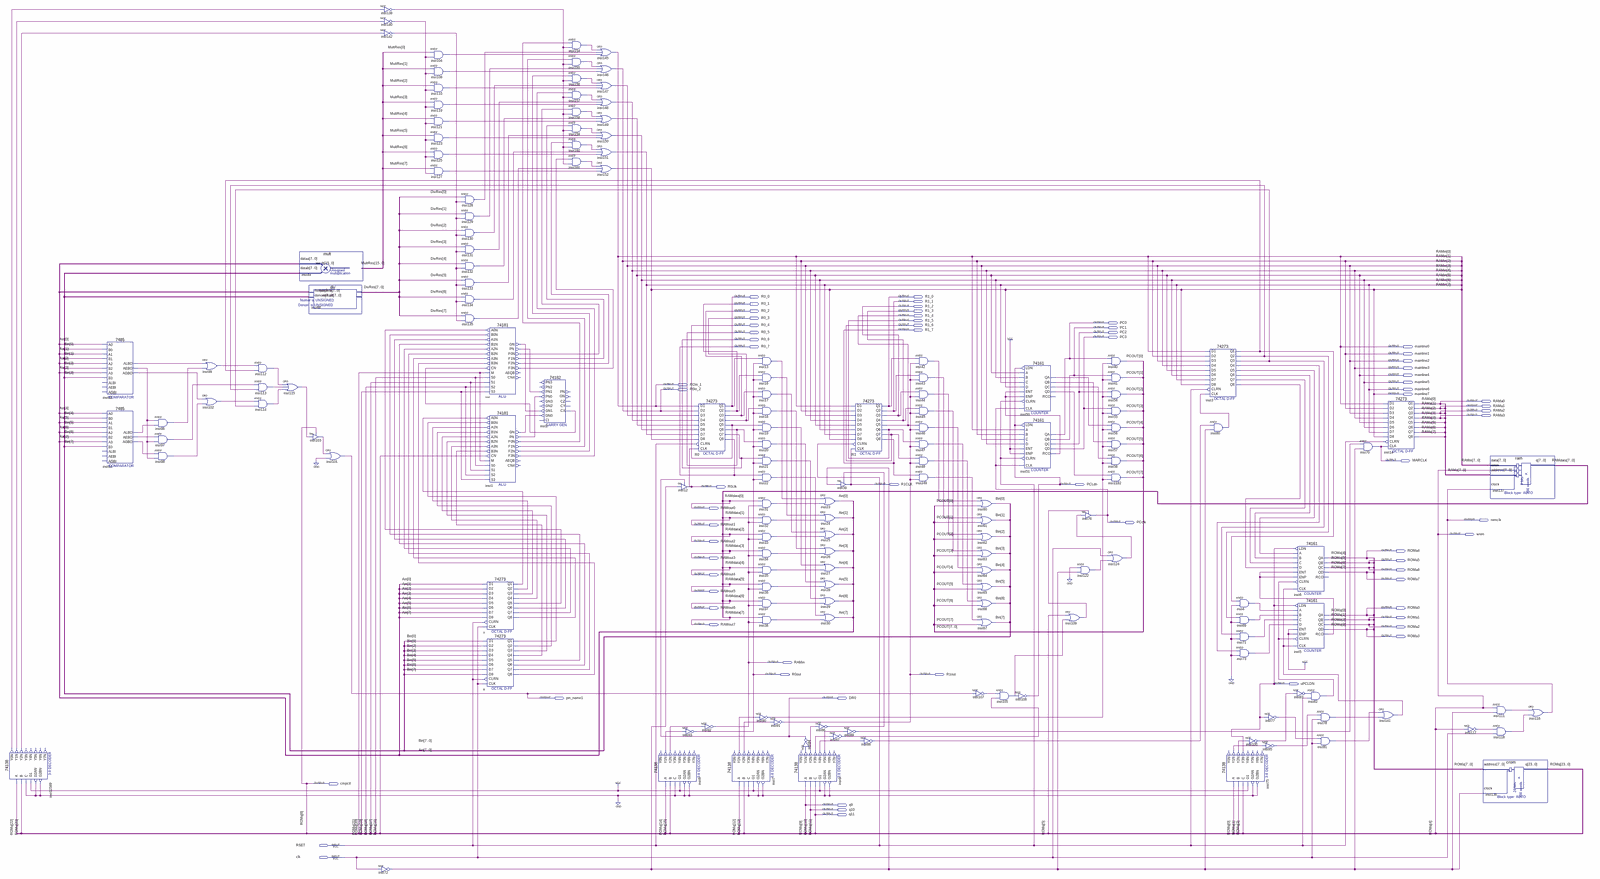
[diagram p0: schematic sheet, whole]
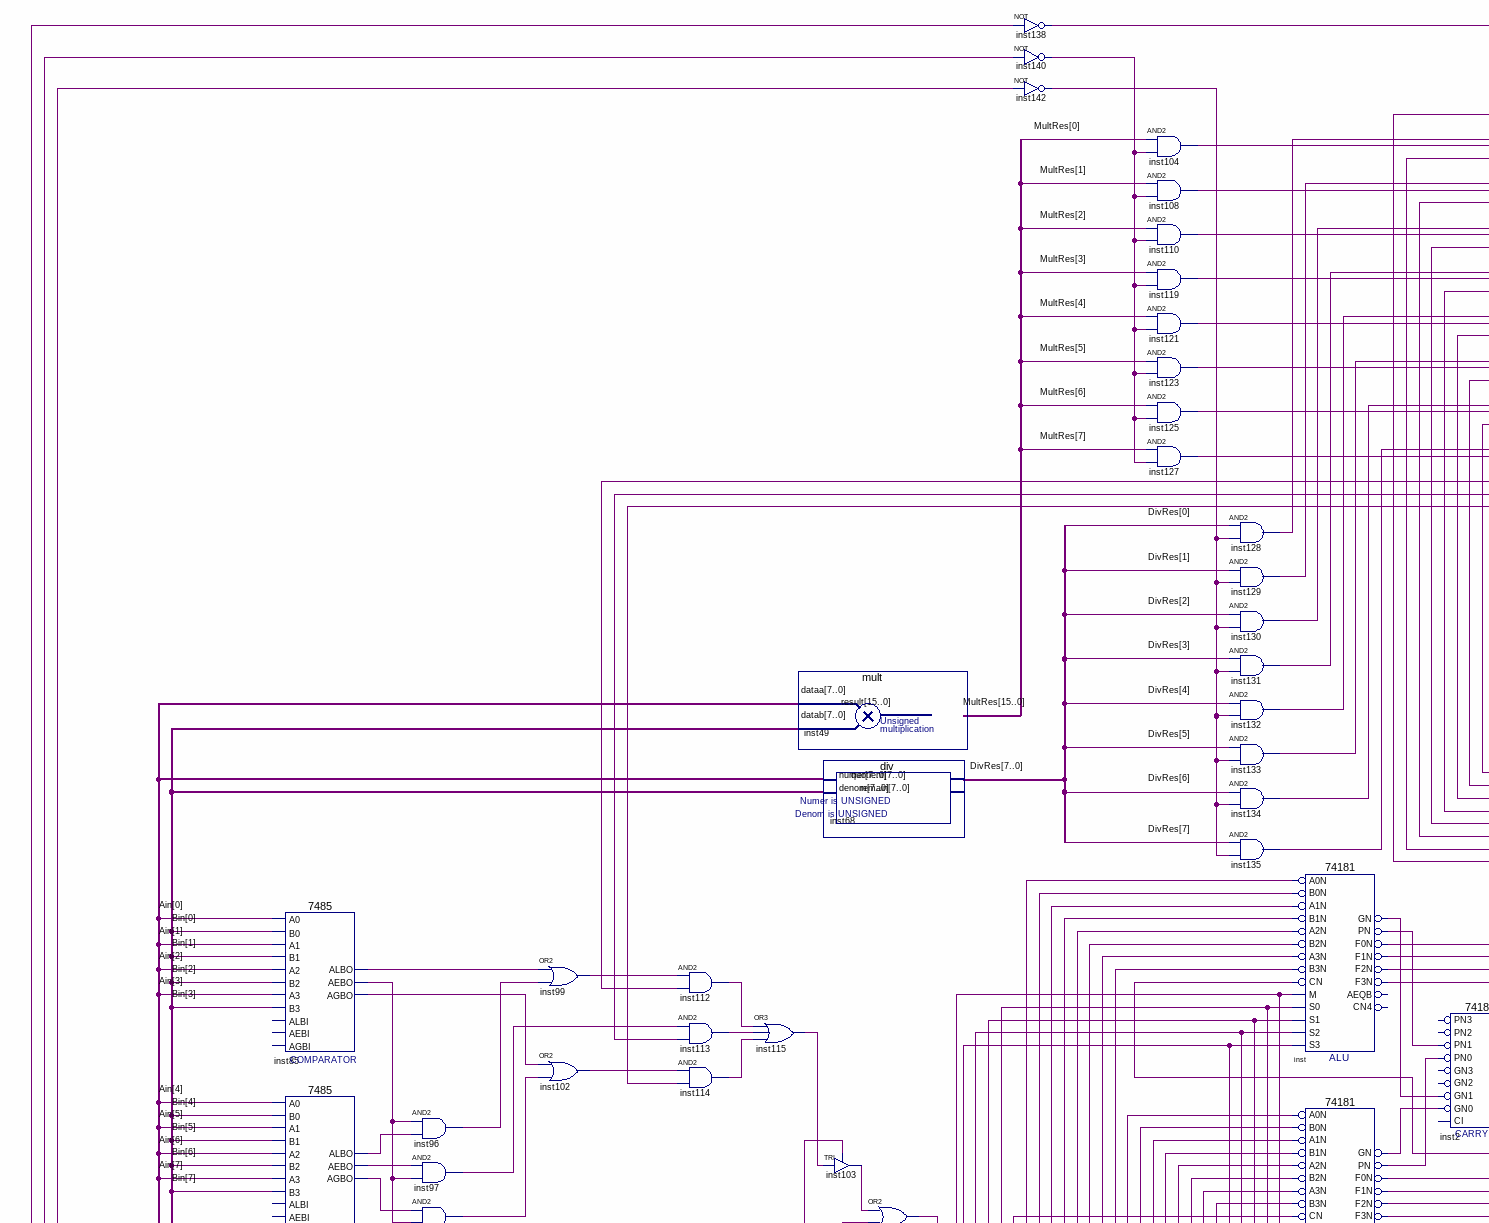
[diagram p1: schematic sheet, upper left part]
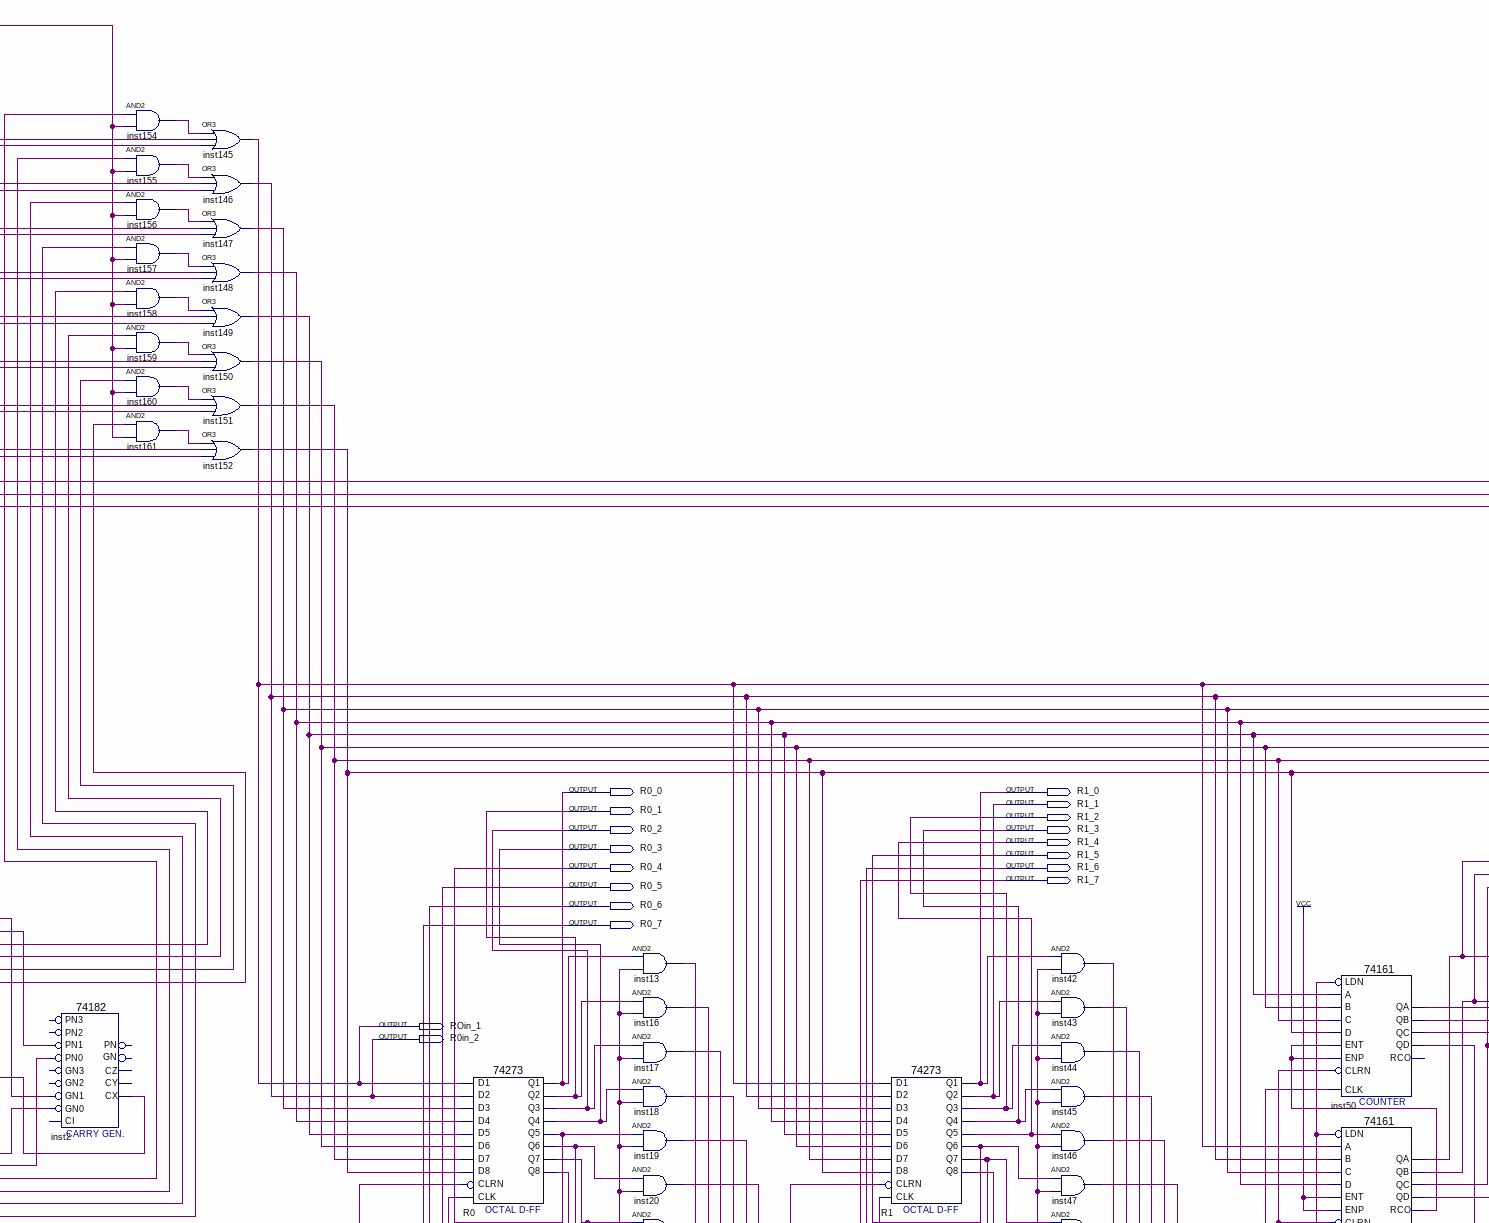
[diagram p2: schematic sheet, upper centre part]
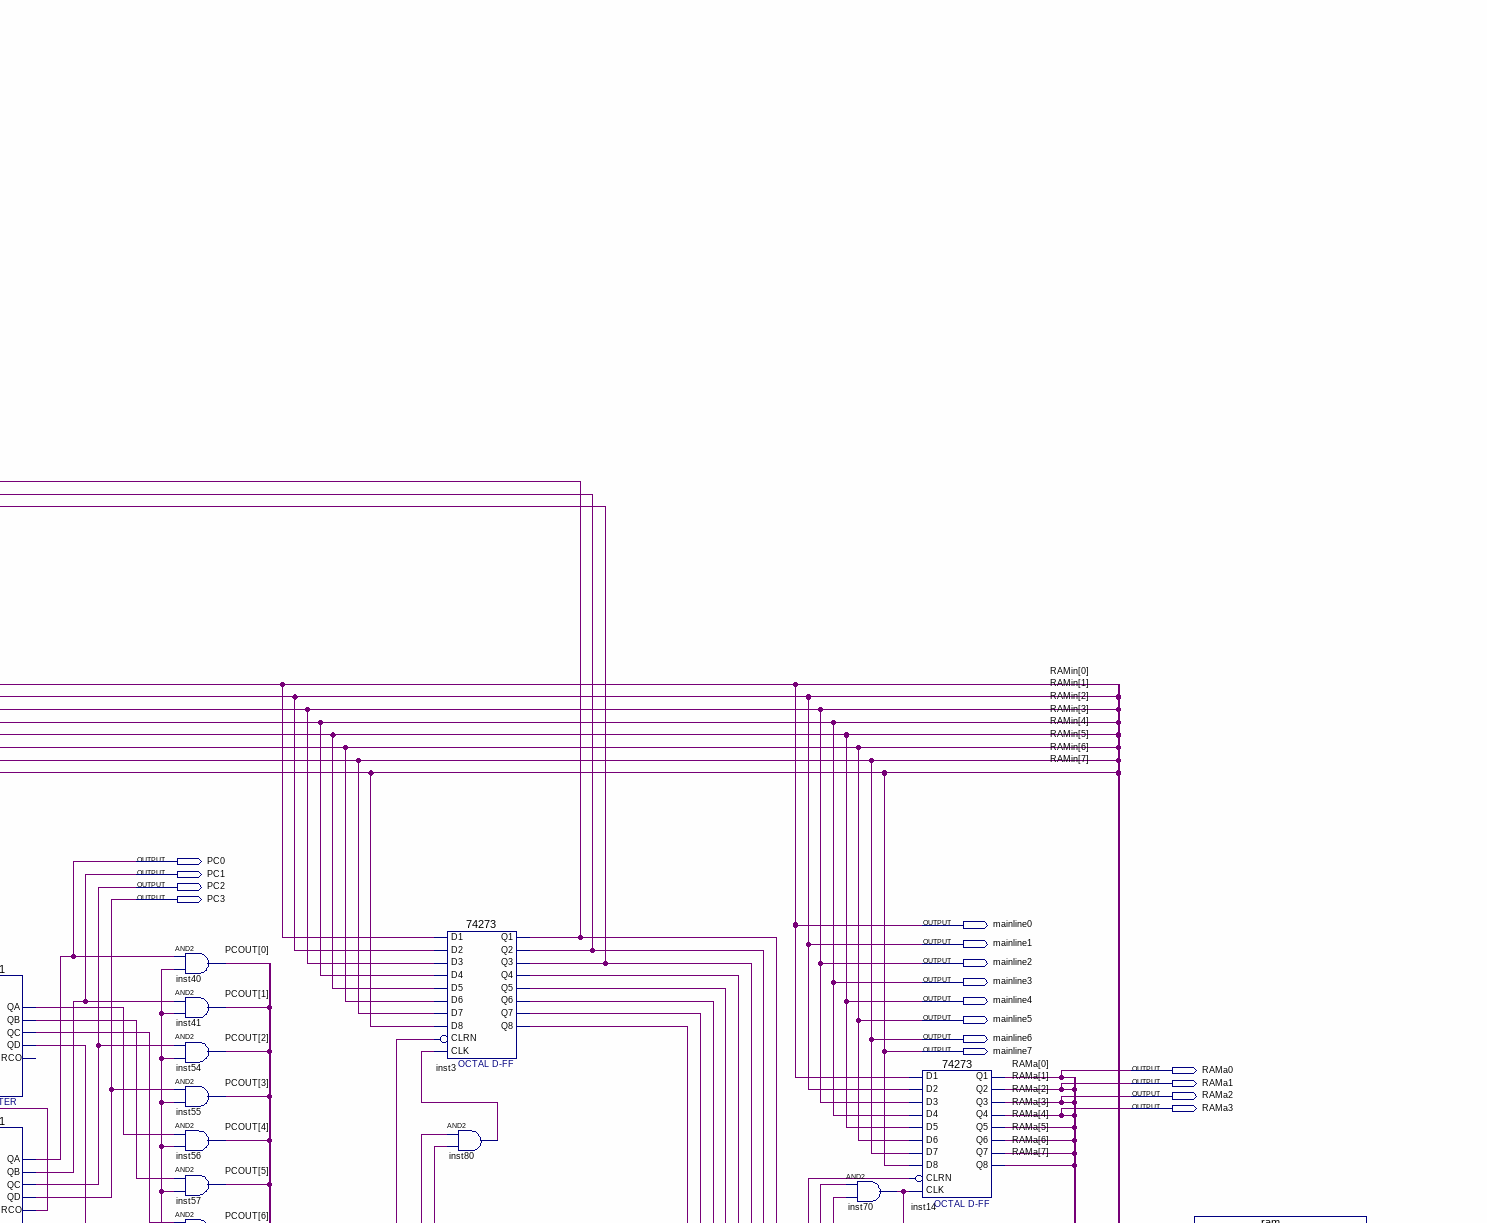
[diagram p3: schematic sheet, upper right part]
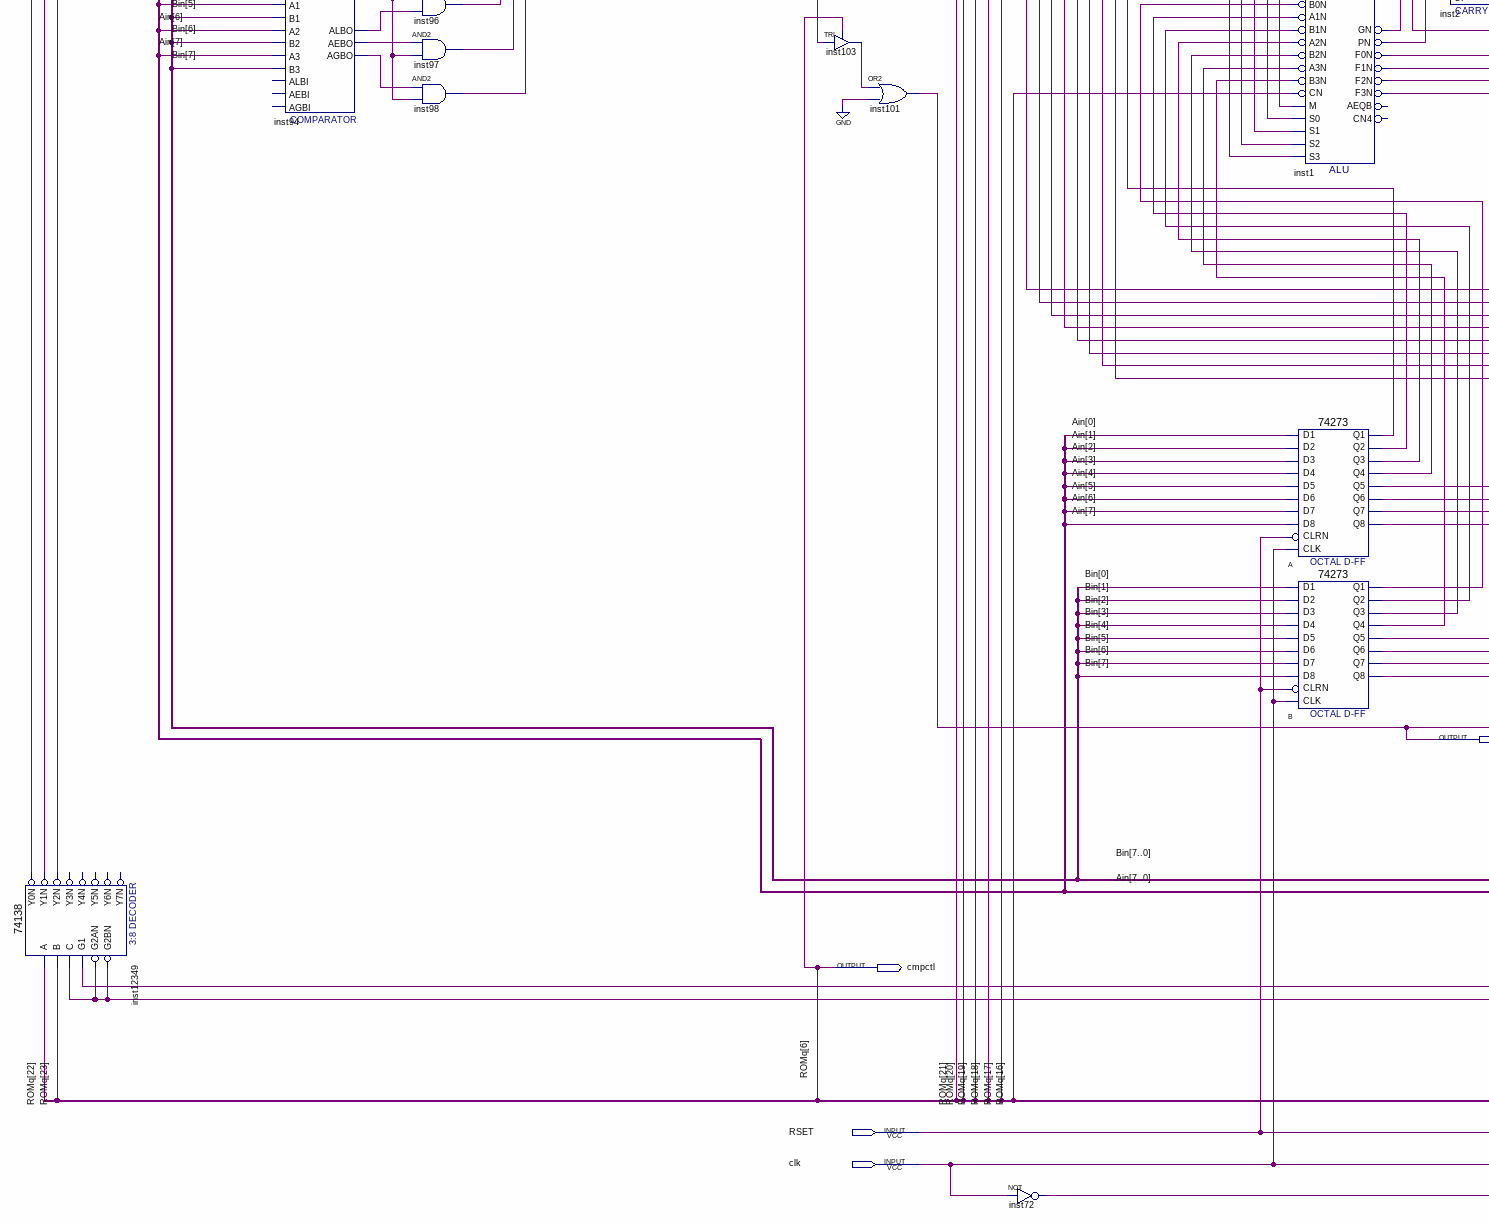
[diagram p4: schematic sheet, lower left part]
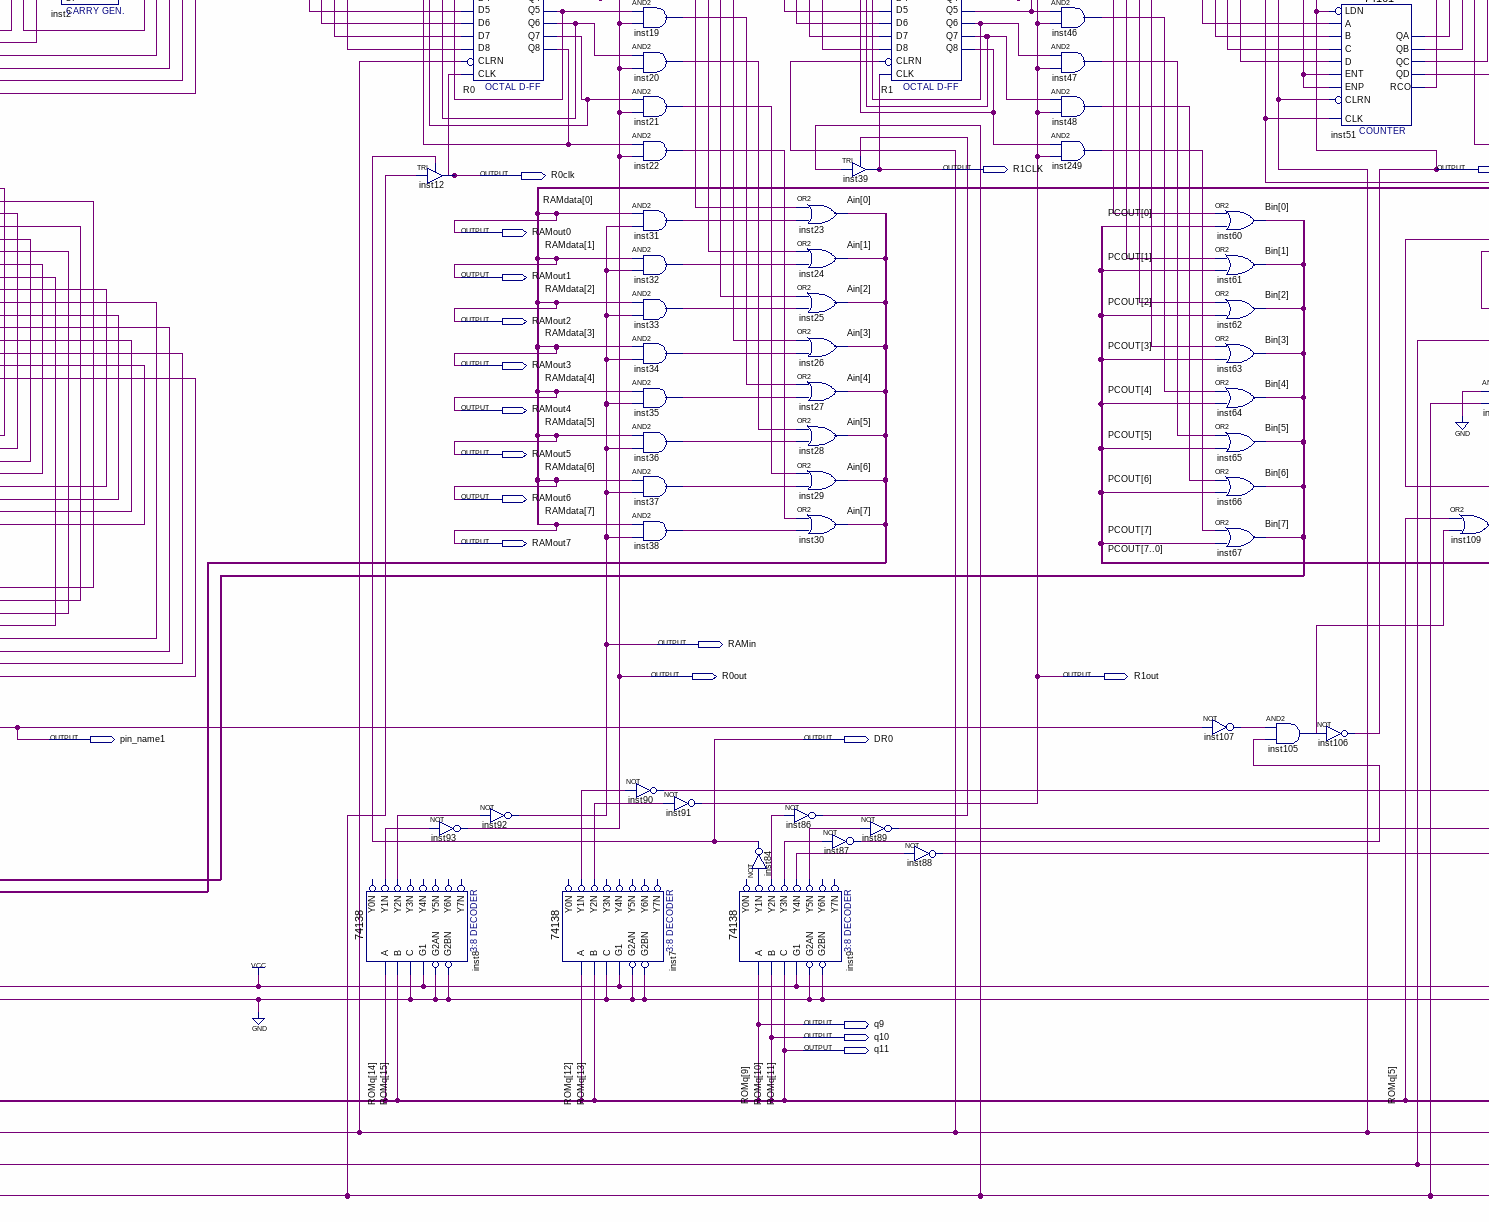
[diagram p5: schematic sheet, lower centre part]
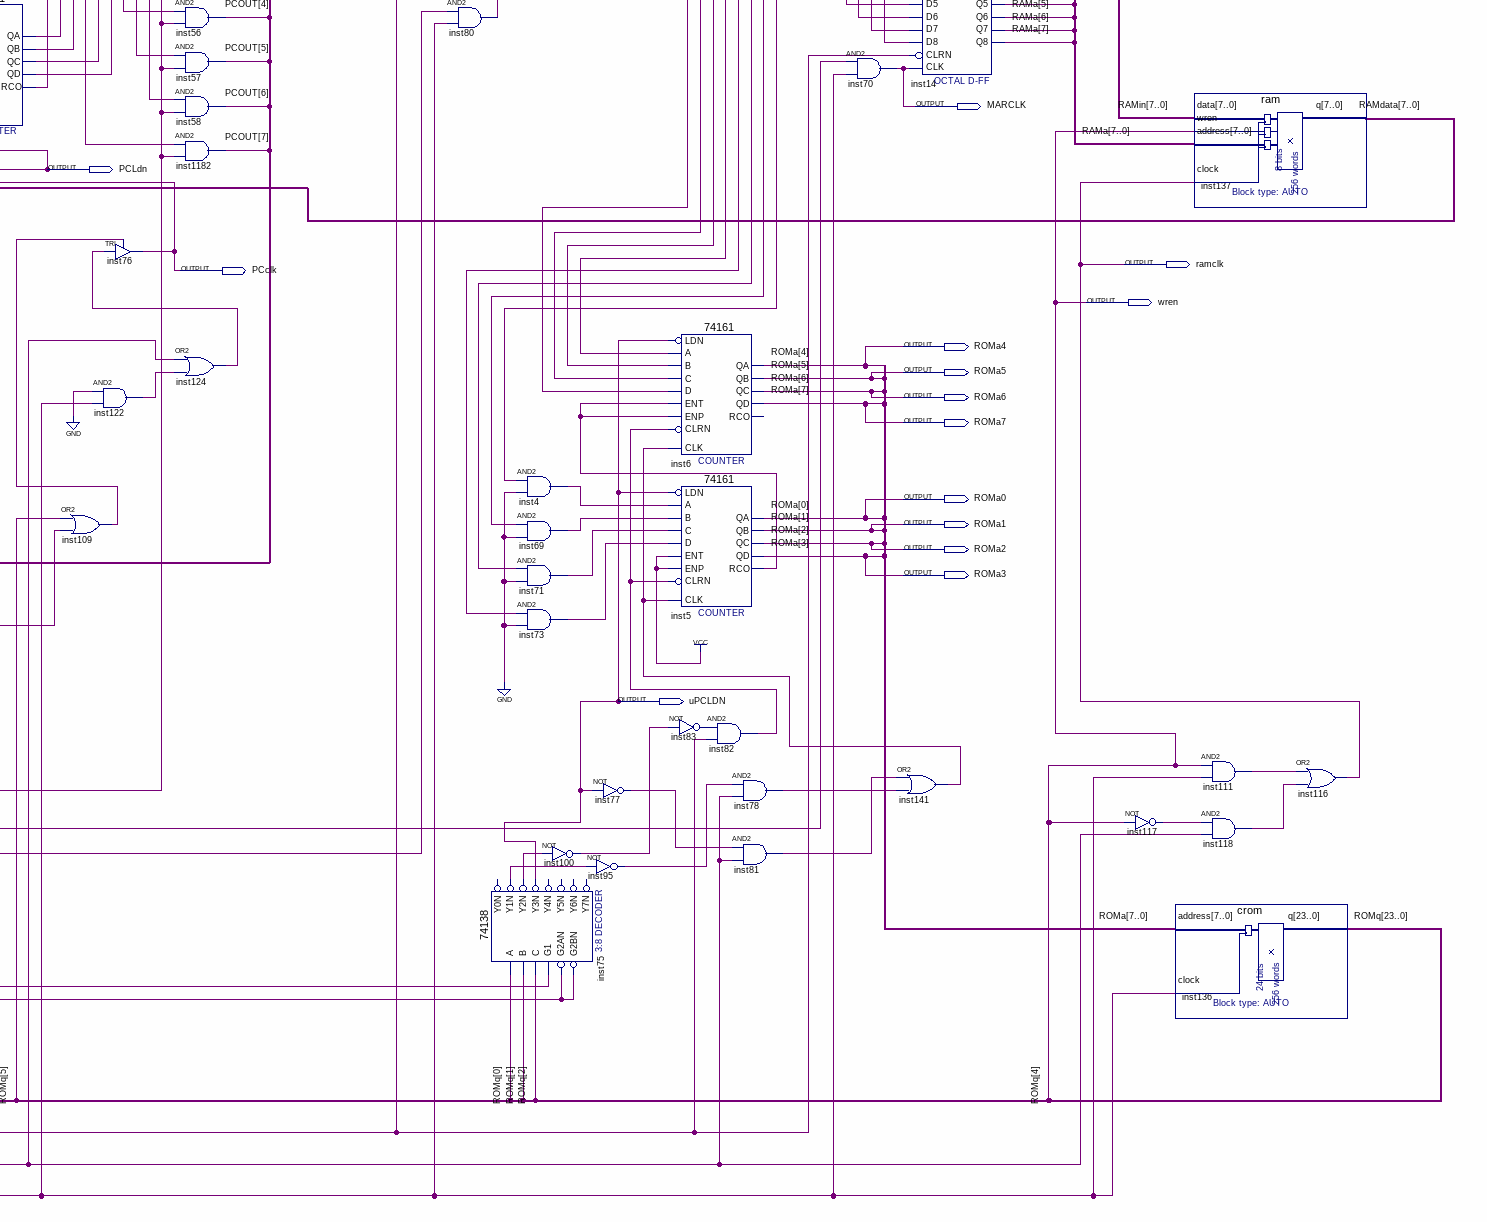
[diagram p6: schematic sheet, lower right part]
// Quartus schematic exp32.bdf as structural Verilog: 155 symbols, 69 pins
module exp32 (
  input  RSET,
  input  clk,
  output R0_0,
  output R1_0,
  output R1_1,
  output R0_1,
  output R1_2,
  output R0_2,
  output R1_3,
  output R1_4,
  output R0_3,
  output R1_5,
  output PC0,
  output R0_4,
  output R1_6,
  output PC1,
  output R1_7,
  output R0_5,
  output PC2,
  output PC3,
  output R0_6,
  output R0_7,
  output mainline0,
  output mainline1,
  output mainline2,
  output mainline3,
  output mainline4,
  output mainline5,
  output ROin_1,
  output R0in_2,
  output mainline6,
  output mainline7,
  output RAMa0,
  output RAMa1,
  output RAMa2,
  output RAMa3,
  output MARCLK,
  output R1CLK,
  output PCLdn,
  output R0clk,
  output RAMout0,
  output ramclk,
  output PCclk,
  output RAMout1,
  output wren,
  output RAMout2,
  output ROMa4,
  output RAMout3,
  output ROMa5,
  output ROMa6,
  output RAMout4,
  output ROMa7,
  output RAMout5,
  output RAMout6,
  output ROMa0,
  output ROMa1,
  output RAMout7,
  output ROMa2,
  output ROMa3,
  output RAMin,
  output R0out,
  output R1out,
  output uPCLDN,
  output pin_name1,
  output DR0,
  output cmpctl,
  output q9,
  output q10,
  output q11
);

  wire A_q1, A_q2, A_q3, A_q4, A_q5, A_q6, A_q7, A_q8, B_q1, B_q2, B_q3, B_q4, B_q5, B_q6, B_q7, B_q8,
       inst1_f0n, inst1_f1n, inst1_f2n, inst1_f3n, inst1_gn, inst1_pn, inst2_cx, inst3_q1, inst3_q2,
       inst3_q3, inst3_q4, inst3_q5, inst3_q6, inst3_q7, inst3_q8, inst4_out, inst5_rco, inst7_y1n,
       inst7_y2n, inst8_y1n, inst8_y2n, inst9_y1n, inst9_y2n, inst9_y3n, inst9_y4n, inst9_y5n, inst13_out,
       inst16_out, inst17_out, inst18_out, inst19_out, inst20_out, inst21_out, inst22_out, inst31_out,
       inst32_out, inst33_out, inst34_out, inst35_out, inst36_out, inst37_out, inst38_out, inst42_out,
       inst43_out, inst44_out, inst45_out, inst46_out, inst47_out, inst48_out, inst50_qa, inst50_qb,
       inst50_qc, inst50_qd, inst51_rco, inst69_out, inst71_out, inst72_out, inst73_out, inst75_y1n,
       inst75_y2n, inst77_out, inst78_out, inst80_out, inst81_out, inst82_out, inst83_out, inst85_aebo,
       inst85_agbo, inst85_albo, inst86_out, inst87_out, inst88_out, inst89_out, inst90_out, inst94_aebo,
       inst94_agbo, inst94_albo, inst95_out, inst96_out, inst97_out, inst98_out, inst99_out, inst100_out,
       inst102_out, inst103_out, inst104_out, inst105_out, inst107_out, inst108_out, inst109_out,
       inst110_out, inst111_out, inst112_out, inst113_out, inst114_out, inst115_out, inst117_out,
       inst118_out, inst119_out, inst121_out, inst122_out, inst123_out, inst124_out, inst125_out,
       inst127_out, inst128_out, inst129_out, inst130_out, inst131_out, inst132_out, inst133_out,
       inst134_out, inst135_out, inst138_out, inst140_out, inst141_out, inst142_out, inst154_out,
       inst155_out, inst156_out, inst157_out, inst158_out, inst159_out, inst160_out, inst161_out,
       inst249_out, inst12349_y0n, inst12349_y1n, inst12349_y2n, inst_f0n, inst_f1n, inst_f2n, inst_f3n,
       inst_gn, inst_pn;
  wire [7:0] Ain, Bin, DivRes, PCOUT;
  wire [7:4] RAMa;
  wire [15:0] MultRes;
  wire [23:0] ROMq;

  \74138  inst12349 (
    .A(ROMq[22]), .B(ROMq[23]), .G1(1'b1), .C(1'b0), .G2AN(1'b0), .G2BN(1'b0), .Y0N(inst12349_y0n),
    .Y1N(inst12349_y1n), .Y2N(inst12349_y2n));  // open: Y3N, Y4N, Y5N, Y6N, Y7N
  \7485  inst85 (
    .A3(Ain[3]), .B2(Bin[2]), .A2(Ain[2]), .A0(Ain[0]), .B0(Bin[0]), .B3(Bin[3]), .A1(Ain[1]), .B1(Bin[1]),
    .ALBO(inst85_albo), .AGBO(inst85_agbo), .AEBO(inst85_aebo));  // open: AEBI, AGBI, ALBI
  \7485  inst94 (
    .A3(Ain[7]), .B2(Bin[6]), .A2(Ain[6]), .A0(Ain[4]), .B0(Bin[4]), .B3(Bin[7]), .A1(Ain[5]), .B1(Bin[5]),
    .ALBO(inst94_albo), .AGBO(inst94_agbo), .AEBO(inst94_aebo));  // open: AEBI, AGBI, ALBI
  and inst96 (inst96_out, inst85_aebo, inst94_albo);
  and inst97 (inst97_out, inst94_aebo, inst85_aebo);
  and inst98 (inst98_out, inst94_agbo, inst85_aebo);
  or inst99 (inst99_out, inst85_albo, inst96_out);
  or inst102 (inst102_out, inst85_agbo, inst98_out);
  and inst112 (inst112_out, inst99_out, inst3_q1);
  and inst113 (inst113_out, inst97_out, inst3_q2);
  and inst114 (inst114_out, inst102_out, inst3_q3);
  or inst115 (inst115_out, inst112_out, inst113_out, inst114_out);
  mult inst49 (.dataa(Ain), .datab(Bin), .result(MultRes));
  div inst68 (.numer(Ain), .denom(Bin), .quotient(DivRes));  // open: remain
  TRI inst103 (.IN(inst115_out), .OE(cmpctl), .OUT(inst103_out));
  or inst101 (pin_name1, inst103_out, 1'b0);
  not inst138 (inst138_out, inst12349_y0n);
  not inst140 (inst140_out, inst12349_y1n);
  not inst142 (inst142_out, inst12349_y2n);
  not inst72 (inst72_out, clk);
  and inst104 (inst104_out, MultRes[0], inst140_out);
  and inst108 (inst108_out, MultRes[1], inst140_out);
  and inst110 (inst110_out, MultRes[2], inst140_out);
  and inst119 (inst119_out, MultRes[3], inst140_out);
  and inst121 (inst121_out, MultRes[4], inst140_out);
  and inst123 (inst123_out, MultRes[5], inst140_out);
  and inst125 (inst125_out, MultRes[6], inst140_out);
  and inst127 (inst127_out, MultRes[7], inst140_out);
  and inst128 (inst128_out, DivRes[0], inst142_out);
  and inst129 (inst129_out, DivRes[1], inst142_out);
  and inst130 (inst130_out, DivRes[2], inst142_out);
  and inst131 (inst131_out, DivRes[3], inst142_out);
  and inst132 (inst132_out, DivRes[4], inst142_out);
  and inst133 (inst133_out, DivRes[5], inst142_out);
  and inst134 (inst134_out, DivRes[6], inst142_out);
  and inst135 (inst135_out, DivRes[7], inst142_out);
  \74273  A (
    .D2(Ain[1]), .D3(Ain[2]), .D1(Ain[0]), .D4(Ain[3]), .D7(Ain[6]), .D6(Ain[5]), .D5(Ain[4]), .D8(Ain[7]),
    .CLK(clk), .CLRN(RSET), .Q4(A_q4), .Q1(A_q1), .Q2(A_q2), .Q3(A_q3), .Q6(A_q6), .Q5(A_q5), .Q7(A_q7),
    .Q8(A_q8));
  \74273  B (
    .D2(Bin[1]), .D3(Bin[2]), .D1(Bin[0]), .D4(Bin[3]), .D7(Bin[6]), .D6(Bin[5]), .D5(Bin[4]), .D8(Bin[7]),
    .CLK(clk), .CLRN(RSET), .Q4(B_q4), .Q1(B_q1), .Q2(B_q2), .Q3(B_q3), .Q6(B_q6), .Q5(B_q5), .Q7(B_q7),
    .Q8(B_q8));
  \74181  inst (
    .B0N(B_q5), .A0N(A_q5), .A1N(A_q6), .B1N(B_q6), .A3N(A_q8), .B2N(B_q7), .A2N(A_q7), .M(ROMq[21]),
    .CN(inst2_cx), .B3N(B_q8), .S2(ROMq[19]), .S1(ROMq[18]), .S0(ROMq[17]), .S3(ROMq[20]), .PN(inst_pn),
    .GN(inst_gn), .F3N(inst_f3n), .F1N(inst_f1n), .F0N(inst_f0n), .F2N(inst_f2n));  // open: AEQB, CN4
  \74181  inst1 (
    .B0N(B_q1), .A0N(A_q1), .A1N(A_q2), .B1N(B_q2), .A3N(A_q4), .B2N(B_q3), .A2N(A_q3), .M(ROMq[21]),
    .CN(ROMq[16]), .B3N(B_q4), .S2(ROMq[19]), .S1(ROMq[18]), .S0(ROMq[17]), .S3(ROMq[20]), .PN(inst1_pn),
    .GN(inst1_gn), .F3N(inst1_f3n), .F1N(inst1_f1n), .F0N(inst1_f0n), .F2N(inst1_f2n));  // open: AEQB, CN4
  \74182  inst2 (
    .PN1(inst_pn), .PN0(inst1_pn), .GN1(inst_gn), .GN0(inst1_gn), .CX(inst2_cx));  // open: PN2, GN2, GN3, PN3, CI, CY, PN, CZ, GN
  and inst154 (inst154_out, inst1_f0n, inst138_out);
  and inst155 (inst155_out, inst1_f1n, inst138_out);
  and inst156 (inst156_out, inst1_f2n, inst138_out);
  and inst157 (inst157_out, inst1_f3n, inst138_out);
  and inst158 (inst158_out, inst_f0n, inst138_out);
  and inst159 (inst159_out, inst_f1n, inst138_out);
  and inst160 (inst160_out, inst_f2n, inst138_out);
  and inst161 (inst161_out, inst_f3n, inst138_out);
  or inst145 (mainline0, inst154_out, inst128_out, inst104_out);
  or inst146 (mainline1, inst155_out, inst129_out, inst108_out);
  or inst147 (mainline2, inst156_out, inst130_out, inst110_out);
  or inst148 (mainline3, inst157_out, inst131_out, inst119_out);
  or inst149 (mainline4, inst158_out, inst132_out, inst121_out);
  or inst150 (mainline5, inst159_out, inst133_out, inst123_out);
  or inst151 (mainline6, inst160_out, inst134_out, inst125_out);
  or inst152 (mainline7, inst161_out, inst135_out, inst127_out);
  \74138  inst8 (
    .A(ROMq[14]), .B(ROMq[15]), .G1(1'b1), .C(1'b0), .G2AN(1'b0), .G2BN(1'b0), .Y1N(inst8_y1n),
    .Y2N(inst8_y2n));  // open: Y0N, Y3N, Y4N, Y5N, Y6N, Y7N
  TRI inst12 (.IN(inst72_out), .OE(DR0), .OUT(R0clk));
  not inst93 (R0out, inst8_y1n);
  \74273  R0 (
    .D2(mainline1), .D3(mainline2), .D1(mainline0), .D4(mainline3), .D7(mainline6), .D6(mainline5),
    .D5(mainline4), .D8(mainline7), .CLK(R0clk), .CLRN(RSET), .Q4(R0_3), .Q1(R0_0), .Q2(R0_1), .Q3(R0_2),
    .Q6(R0_5), .Q5(R0_4), .Q7(R0_6), .Q8(R0_7));
  not inst92 (RAMin, inst8_y2n);
  \74138  inst7 (
    .A(ROMq[12]), .B(ROMq[13]), .G1(1'b1), .C(1'b0), .G2AN(1'b0), .G2BN(1'b0), .Y1N(inst7_y1n),
    .Y2N(inst7_y2n));  // open: Y0N, Y3N, Y4N, Y5N, Y6N, Y7N
  and inst13 (inst13_out, R0_0, R0out);
  and inst16 (inst16_out, R0_1, R0out);
  and inst17 (inst17_out, R0_2, R0out);
  and inst18 (inst18_out, R0_3, R0out);
  and inst19 (inst19_out, R0_4, R0out);
  and inst20 (inst20_out, R0_5, R0out);
  and inst21 (inst21_out, R0_6, R0out);
  and inst22 (inst22_out, R0_7, R0out);
  and inst31 (inst31_out, RAMout0, RAMin);
  and inst32 (inst32_out, RAMout1, RAMin);
  and inst33 (inst33_out, RAMout2, RAMin);
  and inst34 (inst34_out, RAMout3, RAMin);
  and inst35 (inst35_out, RAMout4, RAMin);
  and inst36 (inst36_out, RAMout5, RAMin);
  and inst37 (inst37_out, RAMout6, RAMin);
  and inst38 (inst38_out, RAMout7, RAMin);
  not inst90 (inst90_out, inst7_y1n);
  not inst91 (R1out, inst7_y2n);
  not inst84 (DR0, inst9_y1n);
  \74138  inst9 (
    .A(q9), .B(q10), .G1(1'b1), .C(q11), .G2AN(1'b0), .G2BN(1'b0), .Y1N(inst9_y1n), .Y2N(inst9_y2n),
    .Y3N(inst9_y3n), .Y4N(inst9_y4n), .Y5N(inst9_y5n));  // open: Y0N, Y6N, Y7N
  or inst23 (Ain[0], inst13_out, inst31_out);
  or inst24 (Ain[1], inst16_out, inst32_out);
  or inst25 (Ain[2], inst17_out, inst33_out);
  or inst26 (Ain[3], inst18_out, inst34_out);
  or inst27 (Ain[4], inst19_out, inst35_out);
  or inst28 (Ain[5], inst20_out, inst36_out);
  or inst29 (Ain[6], inst21_out, inst37_out);
  or inst30 (Ain[7], inst22_out, inst38_out);
  not inst86 (inst86_out, inst9_y2n);
  TRI inst39 (.IN(inst72_out), .OE(inst86_out), .OUT(R1CLK));
  not inst89 (inst89_out, inst9_y5n);
  not inst87 (inst87_out, inst9_y3n);
  \74273  R1 (
    .D2(mainline1), .D3(mainline2), .D1(mainline0), .D4(mainline3), .D7(mainline6), .D6(mainline5),
    .D5(mainline4), .D8(mainline7), .CLK(R1CLK), .CLRN(RSET), .Q4(R1_3), .Q1(R1_0), .Q2(R1_1), .Q3(R1_2),
    .Q6(R1_5), .Q5(R1_4), .Q7(R1_6), .Q8(R1_7));
  not inst88 (inst88_out, inst9_y4n);
  and inst42 (inst42_out, R1_0, R1out);
  and inst43 (inst43_out, R1_1, R1out);
  and inst44 (inst44_out, R1_2, R1out);
  and inst45 (inst45_out, R1_3, R1out);
  and inst46 (inst46_out, R1_4, R1out);
  and inst47 (inst47_out, R1_5, R1out);
  and inst48 (inst48_out, R1_6, R1out);
  and inst249 (inst249_out, R1_7, R1out);
  or inst60 (Bin[0], inst42_out, PCOUT[0]);
  or inst61 (Bin[1], inst43_out, PCOUT[1]);
  or inst62 (Bin[2], inst44_out, PCOUT[2]);
  or inst63 (Bin[3], inst45_out, PCOUT[3]);
  or inst64 (Bin[4], inst46_out, PCOUT[4]);
  or inst65 (Bin[5], inst47_out, PCOUT[5]);
  or inst66 (Bin[6], inst48_out, PCOUT[6]);
  or inst67 (Bin[7], inst249_out, PCOUT[7]);
  not inst107 (inst107_out, pin_name1);
  and inst105 (inst105_out, inst107_out, inst87_out);
  not inst106 (PCLdn, inst105_out);
  \74161  inst50 (
    .CLRN(RSET), .CLK(PCclk), .ENP(inst51_rco), .LDN(PCLdn), .A(mainline4), .D(mainline7), .ENT(inst51_rco),
    .B(mainline5), .C(mainline6), .QD(inst50_qd), .QC(inst50_qc), .QB(inst50_qb), .QA(inst50_qa));  // open: RCO
  \74161  inst51 (
    .CLRN(RSET), .CLK(PCclk), .ENP(1'b1), .LDN(PCLdn), .A(mainline0), .D(mainline3), .ENT(1'b1),
    .B(mainline1), .C(mainline2), .QD(PC3), .QC(PC2), .QB(PC1), .QA(PC0), .RCO(inst51_rco));
  or inst109 (inst109_out, ROMq[5], inst105_out);
  TRI inst76 (.IN(inst124_out), .OE(inst109_out), .OUT(PCclk));
  and inst122 (inst122_out, 1'b0, inst72_out);
  and inst40 (PCOUT[0], PC0, inst90_out);
  and inst41 (PCOUT[1], PC1, inst90_out);
  and inst54 (PCOUT[2], PC2, inst90_out);
  and inst55 (PCOUT[3], PC3, inst90_out);
  and inst56 (PCOUT[4], inst50_qa, inst90_out);
  and inst57 (PCOUT[5], inst50_qb, inst90_out);
  and inst58 (PCOUT[6], inst50_qc, inst90_out);
  and inst1182 (PCOUT[7], inst50_qd, inst90_out);
  or inst124 (inst124_out, clk, inst122_out);
  \74273  inst3 (
    .D2(mainline1), .D3(mainline2), .D1(mainline0), .D4(mainline3), .D7(mainline6), .D6(mainline5),
    .D5(mainline4), .D8(mainline7), .CLK(inst80_out), .CLRN(RSET), .Q4(inst3_q4), .Q1(inst3_q1),
    .Q2(inst3_q2), .Q3(inst3_q3), .Q6(inst3_q6), .Q5(inst3_q5), .Q7(inst3_q7), .Q8(inst3_q8));
  and inst80 (inst80_out, inst88_out, inst72_out);
  \74138  inst75 (
    .A(ROMq[0]), .B(ROMq[1]), .G1(1'b1), .C(ROMq[2]), .G2AN(1'b0), .G2BN(1'b0), .Y1N(inst75_y1n),
    .Y2N(inst75_y2n), .Y3N(uPCLDN));  // open: Y0N, Y4N, Y5N, Y6N, Y7N
  and inst4 (inst4_out, inst3_q1, 1'b0);
  and inst69 (inst69_out, inst3_q2, 1'b0);
  and inst71 (inst71_out, inst3_q3, 1'b0);
  and inst73 (inst73_out, inst3_q4, 1'b0);
  not inst100 (inst100_out, inst75_y2n);
  not inst95 (inst95_out, inst75_y1n);
  not inst77 (inst77_out, uPCLDN);
  \74161  inst6 (
    .CLRN(inst82_out), .CLK(inst141_out), .ENP(inst5_rco), .LDN(uPCLDN), .A(inst3_q5), .D(inst3_q8),
    .ENT(inst5_rco), .B(inst3_q6), .C(inst3_q7), .QD(ROMa7), .QC(ROMa6), .QB(ROMa5), .QA(ROMa4));  // open: RCO
  \74161  inst5 (
    .CLRN(inst82_out), .CLK(inst141_out), .ENP(1'b1), .LDN(uPCLDN), .A(inst4_out), .D(inst73_out),
    .ENT(1'b1), .B(inst69_out), .C(inst71_out), .QD(ROMa3), .QC(ROMa2), .QB(ROMa1), .QA(ROMa0),
    .RCO(inst5_rco));
  not inst83 (inst83_out, inst100_out);
  and inst82 (inst82_out, inst83_out, RSET);
  and inst78 (inst78_out, inst95_out, clk);
  and inst81 (inst81_out, inst77_out, clk);
  and inst70 (MARCLK, inst89_out, inst72_out);
  \74273  inst14 (
    .D2(mainline1), .D3(mainline2), .D1(mainline0), .D4(mainline3), .D7(mainline6), .D6(mainline5),
    .D5(mainline4), .D8(mainline7), .CLK(MARCLK), .CLRN(RSET), .Q4(RAMa3), .Q1(RAMa0), .Q2(RAMa1),
    .Q3(RAMa2), .Q6(RAMa[5]), .Q5(RAMa[4]), .Q7(RAMa[6]), .Q8(RAMa[7]));
  or inst141 (inst141_out, inst81_out, inst78_out);
  not inst117 (inst117_out, wren);
  ram inst137 (
    .data({mainline7, mainline6, mainline5, mainline4, mainline3, mainline2, mainline1, mainline0}),
    .wren(wren), .address({RAMa, RAMa3, RAMa2, RAMa1, RAMa0}), .clock(ramclk),
    .q({RAMout7, RAMout6, RAMout5, RAMout4, RAMout3, RAMout2, RAMout1, RAMout0}));
  crom inst136 (
    .address({ROMa7, ROMa6, ROMa5, ROMa4, ROMa3, ROMa2, ROMa1, ROMa0}), .clock(inst72_out),
    .q({ROMq[23:12], q11, q10, q9, ROMq[8:7], cmpctl, ROMq[5], wren, ROMq[3:0]}));
  and inst111 (inst111_out, wren, inst72_out);
  and inst118 (inst118_out, inst117_out, clk);
  or inst116 (ramclk, inst111_out, inst118_out);

  assign R0in_2 = mainline1;
  assign ROin_1 = mainline0;

  // Other names for the same wires on the sheet: ROMq (some bits) = {q11, q10, q9, cmpctl, wren};
  //   RAMin[7:0] = {mainline7, mainline6, mainline5, mainline4, mainline3, mainline2, mainline1, mainline0};
  //   RAMdata[7:0] = {RAMout7, RAMout6, RAMout5, RAMout4, RAMout3, RAMout2, RAMout1, RAMout0}
endmodule
